# Altium project 2LED_Dice.PrjPcb
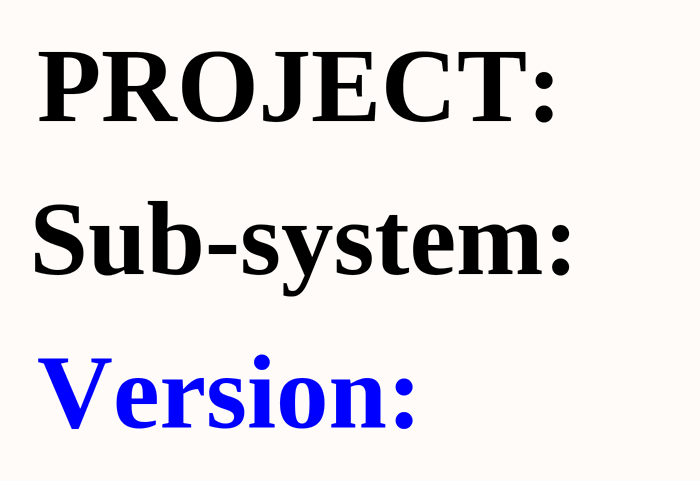
[diagram p0: COVER PAGE.SchDoc]
5 sheets, 54 parts. Net scope: global (net labels, ports and power ports of the same name join across sheets).
Board file: PCB1.PcbDoc
Sheets:
  COVER PAGE.SchDoc
  INDEX.SchDoc
  BLOCK DIAGRAM.SchDoc
  POWER TREE.SchDoc
  SYSTEM.SchDoc

## Sheet COVER PAGE.SchDoc: COVER PAGE
size 420 x 297 mm; Date: March 14; CheckedBy: ThS. Bùi Quốc Bảo; DrawnBy: Nguyễn Gia Huy; Revision: 1.0; SheetNumber: 1; SheetTotal: 5; MasterProject: 2LEDs Dice game; Sub-system: 2LED_Dice.PrjPcb

### Notes on the sheet
- PROJECT:
- Sub-system:
- Version:
- Project:
- Design by:
- Sheet title:
- Sheet
- of
- Checked by:
- Approved by:
- Doc No:
- Revision:
- Size:
- Dates:
- A3

## Sheet INDEX.SchDoc: INDEX
size 420 x 297 mm; Date: March 14; CheckedBy: ThS. Bùi Quốc Bảo; DrawnBy: Nguyễn Gia Huy; Revision: V1.0; SheetNumber: 2; SheetTotal: 5; MasterProject: 2LEDs Dice game; Sub-system: 2LED_Dice.PrjPcb
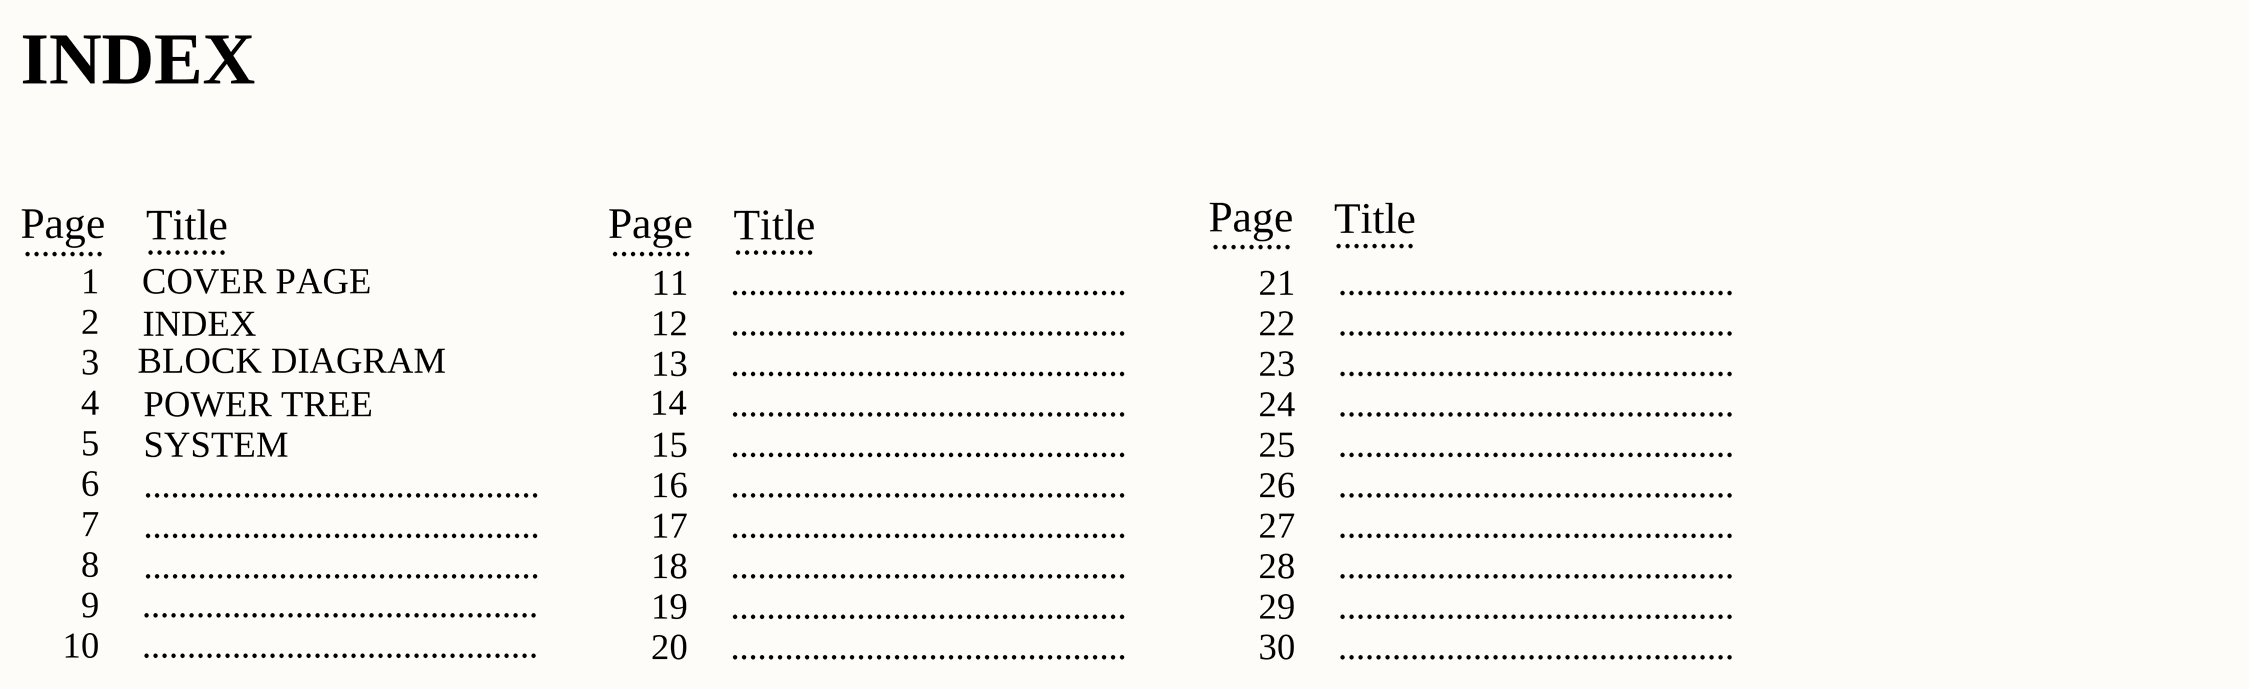
[diagram p1: INDEX.SchDoc]

### Notes on the sheet
- INDEX
- Page
- .........
- Title
- 1
- COVER PAGE
- 11
- ............................................
- 21
- 2
- 3
- BLOCK DIAGRAM
- 12
- 13
- 22
- 23
- 4
- 5
- POWER TREE
- SYSTEM
- 14
- 15
- 24
- 25
- 6
- 16
- 26
- 7
- 8
- 17
- 18
- 27
- 28
- 9
- 10
- 19
- 20
- 29
- 30
- Sub-system:
- Project:
- Design by:
- Sheet title:
- Sheet
- of
- Checked by:
- Approved by:
- Doc No:
- Revision:
- Size:
- Dates:
- A3

## Sheet BLOCK DIAGRAM.SchDoc: BLOCK DIAGRAM
size 420 x 297 mm; Date: March 14; CheckedBy: ThS. Bùi Quốc Bảo; DrawnBy: Nguyễn Gia Huy; Revision: V1.0; SheetNumber: 3; SheetTotal: 5; MasterProject: 2LEDs Dice game; Sub-system: 2LED_Dice.PrjPcb

### Notes on the sheet
- Sub-system:
- Project:
- Design by:
- Sheet title:
- Sheet
- of
- Checked by:
- Approved by:
- Doc No:
- Revision:
- Size:
- Dates:
- A3
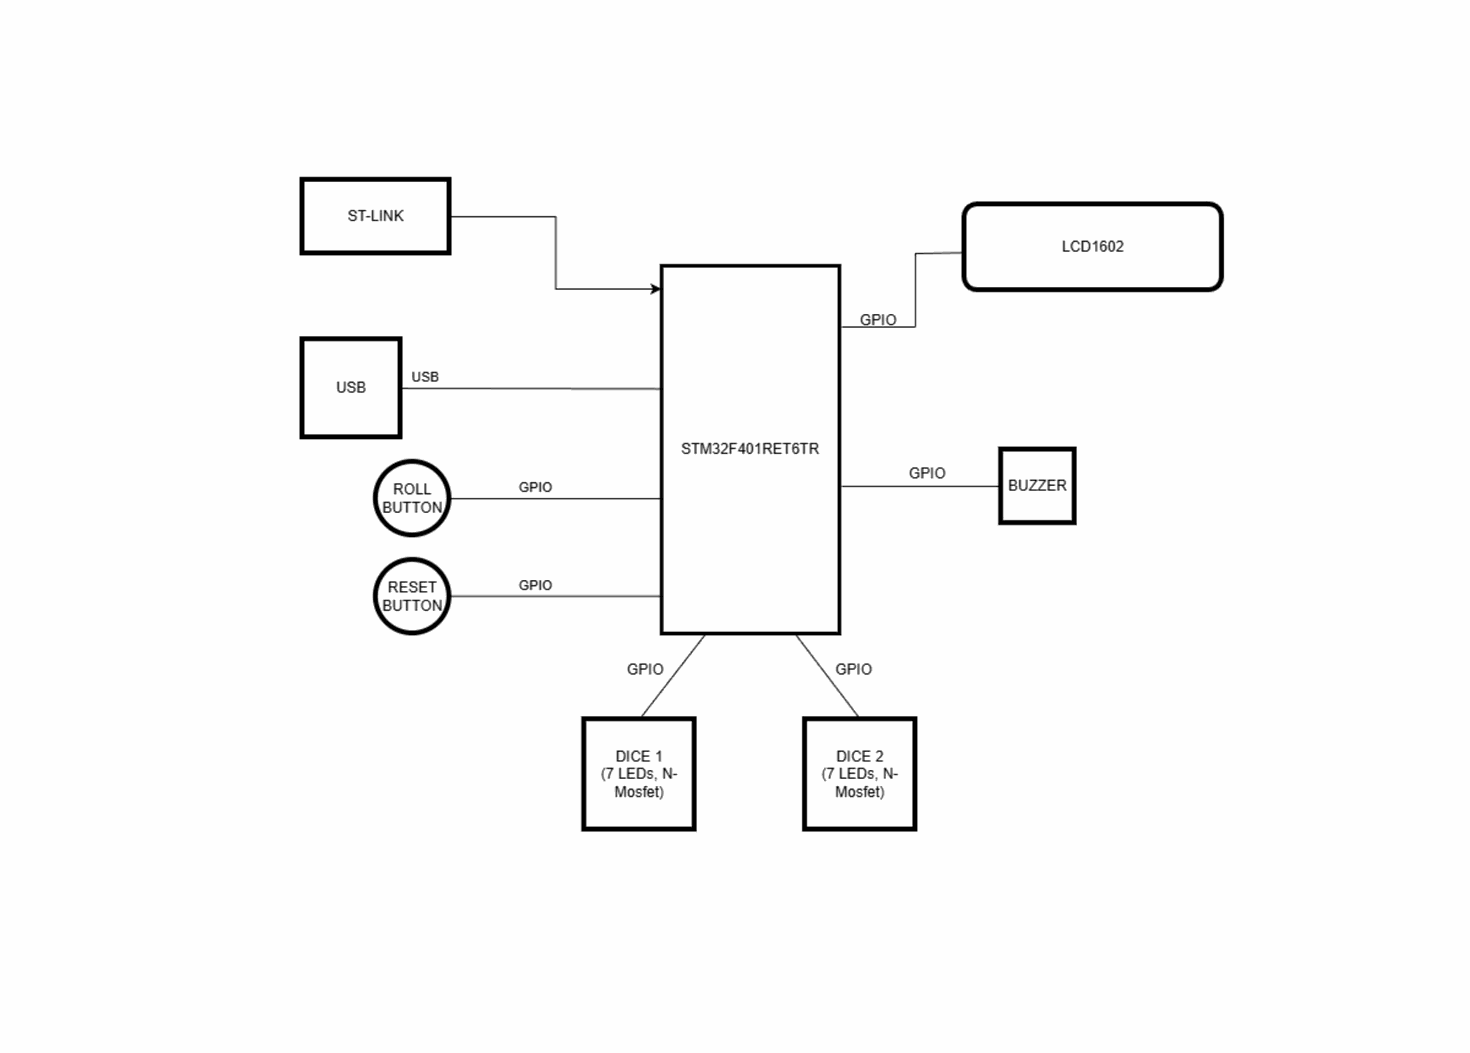
[diagram p2: BLOCK DIAGRAM.SchDoc]

## Sheet POWER TREE.SchDoc: POWER TREE
size 420 x 297 mm; Date: March 14; CheckedBy: ThS. Bùi Quốc Bảo; DrawnBy: Nguyễn Gia Huy; Revision: V1.0; SheetNumber: 4; SheetTotal: 5; MasterProject: 2LEDs Dice game; Sub-system: 2LED_Dice.PrjPcb
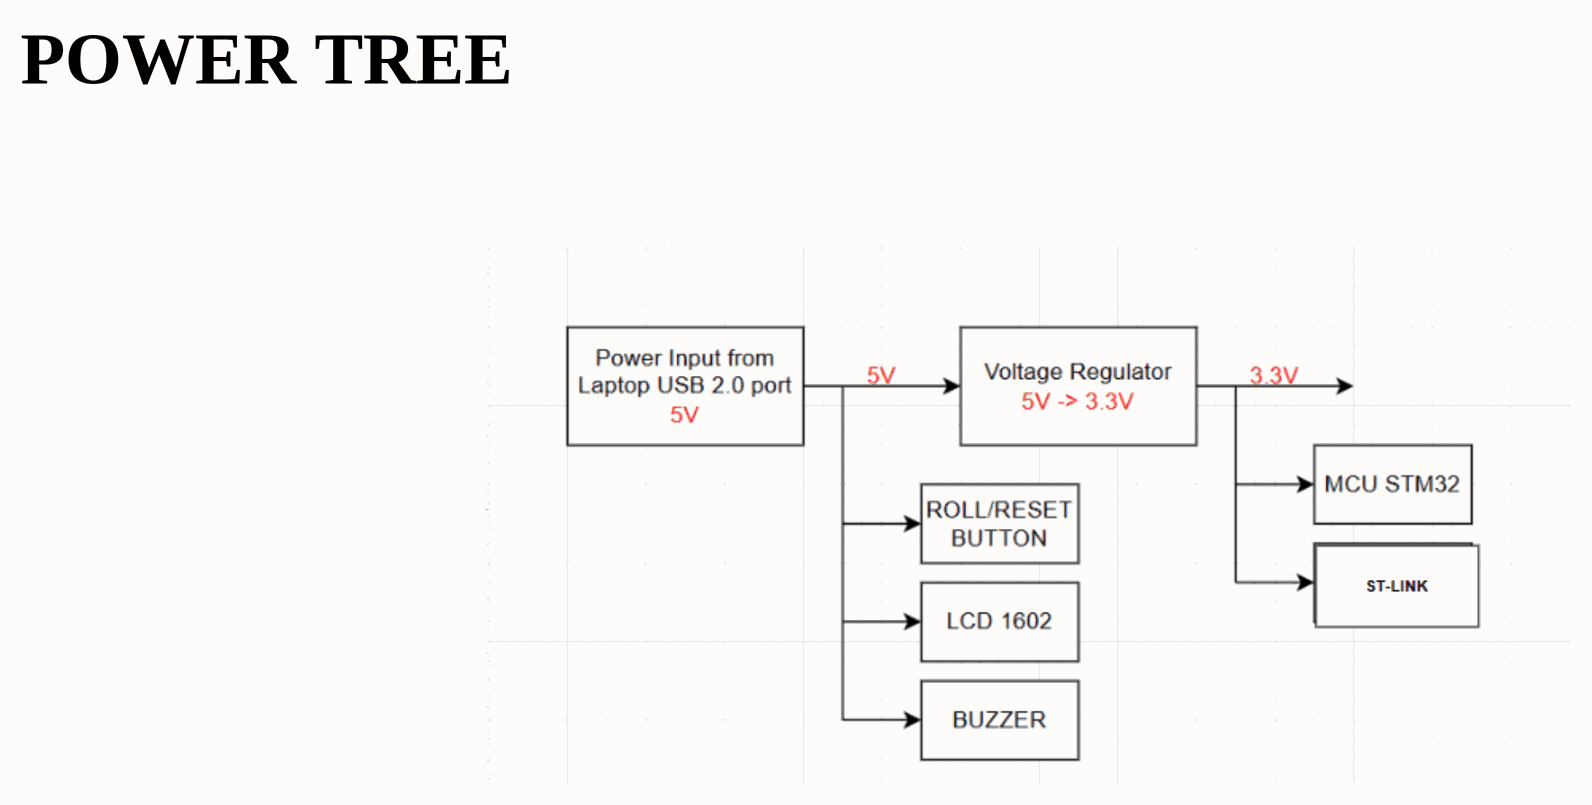
[diagram p3: POWER TREE.SchDoc]

### Notes on the sheet
- POWER TREE
- Sub-system:
- Project:
- Design by:
- Sheet title:
- Sheet
- of
- Checked by:
- Approved by:
- Doc No:
- Revision:
- Size:
- Dates:
- A3

## Sheet SYSTEM.SchDoc: SYSTEM
size 420 x 297 mm; Date: March 14; CheckedBy: ThS. Bùi Quốc Bảo; DrawnBy: Nguyễn Gia Huy; Revision: V1.0; SheetNumber: 5; SheetTotal: 5; MasterProject: 2LEDs Dice game; Sub-system: 2LED_Dice.PrjPcb
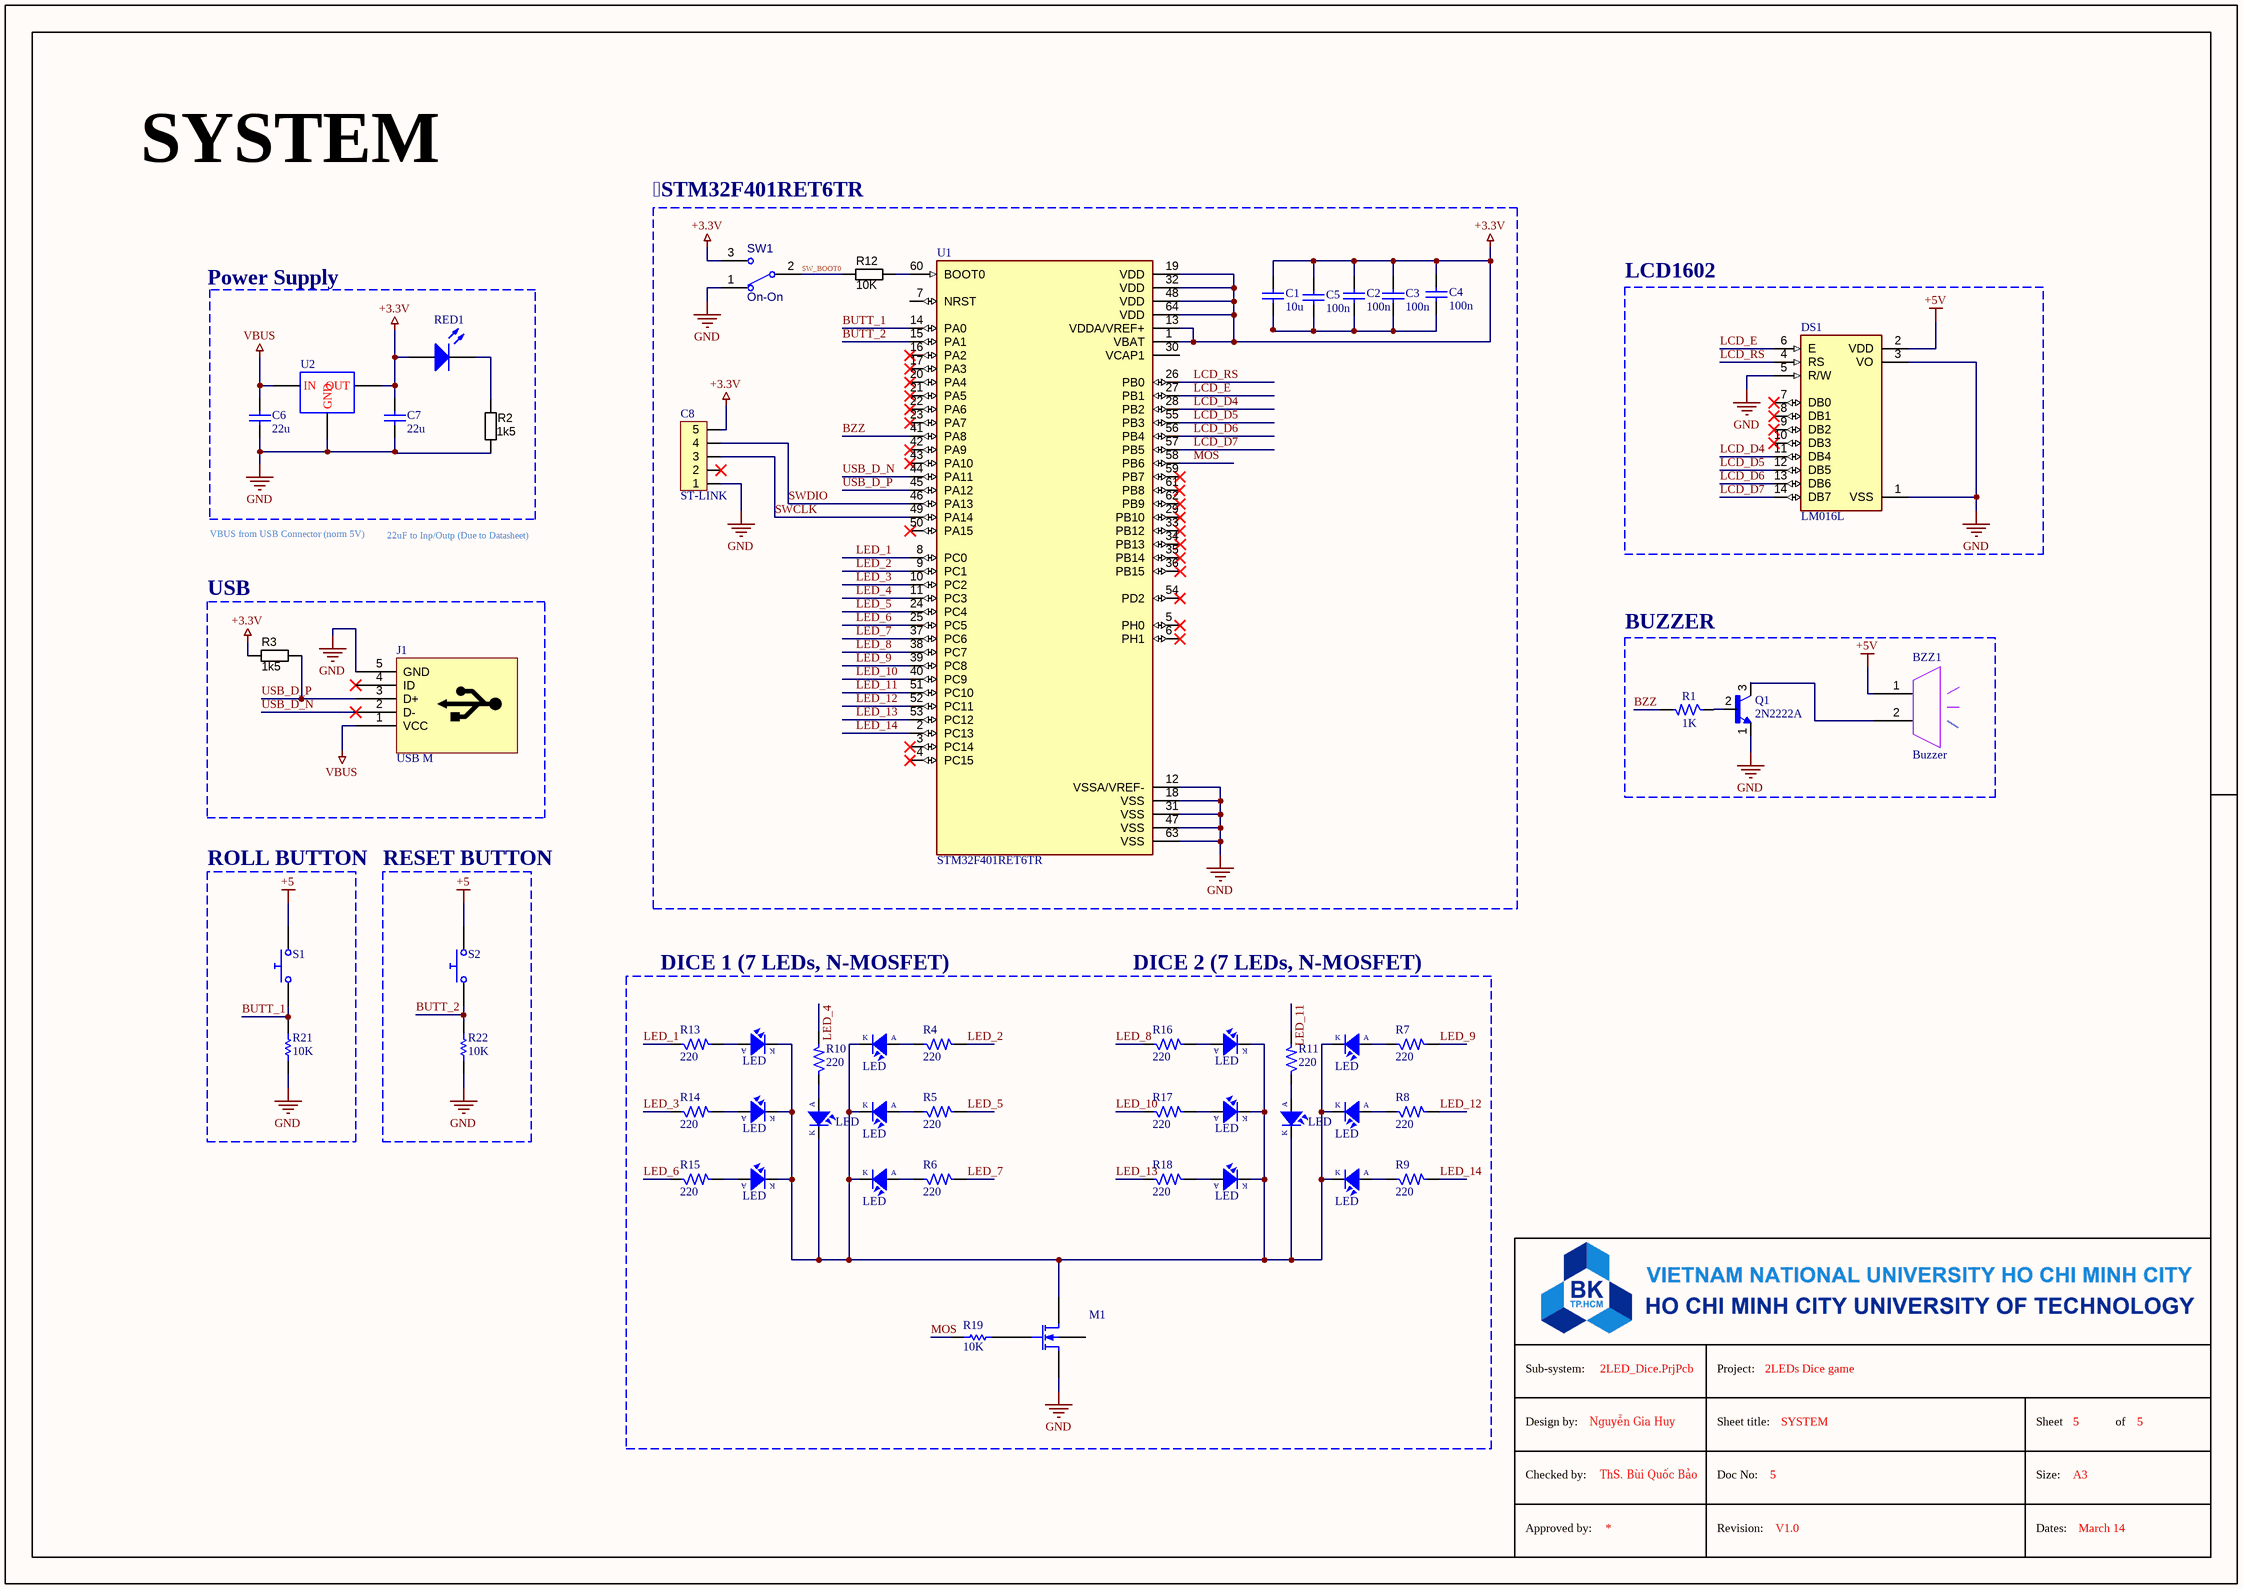
[diagram p4: SYSTEM.SchDoc]

### Parts
BZZ1  Buzzer  [buzzer 5V]
C1  value 10u  [tu 0402]  (hidden comment: Capacitor)
C2  value 100n  [tu 0402]  (hidden comment: Capacitor)
C3  value 100n  [tu 0402]  (hidden comment: Capacitor)
C4  value 100n  [tu 0402]  (hidden comment: Capacitor)
C5  value 100n  [tu 0402]  (hidden comment: Capacitor)
C6  value 22u  [CAPC2012X94N]  (hidden comment: Capacitor)
C7  value 22u  [CAPC2012X94N]  (hidden comment: Capacitor)
C8  ST-LINK  [HDR5]
DS1  LM016L  [MODULE_LCD-16X2]
J1  USB M  [USB-Micr-B-FCI-SMD]
LED1  LED  [LED-3]
LED2  LED  [LED-3]
LED3  LED  [LED-3]
LED4  LED  [LED-3]
LED5  LED  [LED-3]
LED6  LED  [LED-3]
LED7  LED  [LED-3]
LED8  LED  [LED-3]
LED9  LED  [LED-3]
LED10  LED  [LED-3]
LED11  LED  [LED-3]
LED12  LED  [LED-3]
LED13  LED  [LED-3]
LED14  LED  [LED-3]
M1  N-channel MOS1 MOSFET Shichman and Hodges Model  [TO254P1054X469X1930-3]  (value not drawn)
Q1  2N2222A  [TO127P584H533-3]
R1  1K  [RES-SMD-0402]
R2  value 1k5  [RES-SMD-0402]  (hidden comment: Thick Film)
R3  value 1k5  [RES-SMD-0402]  (hidden comment: Thick Film)
R4  220  [RES-SMD-0402]
R5  220  [RES-SMD-0402]
R6  220  [RES-SMD-0402]
R7  220  [RES-SMD-0402]
R8  220  [RES-SMD-0402]
R9  220  [RES-SMD-0402]
R10  220  [RES-SMD-0402]
R11  220  [RES-SMD-0402]
R12  value 10K  [RES-SMD-0402]  (hidden comment: Thick Film)
R13  220  [RES-SMD-0402]
R14  220  [RES-SMD-0402]
R15  220  [RES-SMD-0402]
R16  220  [RES-SMD-0402]
R17  220  [RES-SMD-0402]
R18  220  [RES-SMD-0402]
R19  value 10K  [RES-SMD-0402]  (hidden comment: Resistor)
R21  value 10K  [RES-SMD-0402]  (hidden comment: Resistor)
R22  value 10K  [RES-SMD-0402]  (hidden comment: Resistor)
RED1  Light-Emitting Diode  [LED-RED-0805]  (value not drawn)
S1  Push Button Normally Opened  [SW4_SMD]  (value not drawn)
S2  Push Button Normally Opened  [SW4_SMD]  (value not drawn)
SW1  ON-ON  [SW4_SMD]
U1  STM32F401RET6TR  [QFP50P1200X1200X160-64N]
U2  Positive Fixed Voltage regulator  [AMS1117_3v3]  (value not drawn)

### Blocks framed on the sheet
STM32F401RET6TR: C1-C5 C8 R12 SW1 U1
Power Supply: C6 C7 R2 RED1 U2
LCD1602: DS1
USB: J1 R3
BUZZER: BZZ1 Q1 R1
ROLL BUTTON: R21 S1
RESET BUTTON: R22 S2

### Nets
+3.3V: C1.1 C2.1 C3.1 C4.1 C5.1 C7.1 C8.5 R3.1 RED1.1(A) SW1.3 U1.1(VBAT) U1.13(VDDA/VREF+) U1.19(VDD) U1.32(VDD) U1.48(VDD) U1.64(VDD) U2.3(OUT)
+5: S1.2 S2.2
+5V: BZZ1.1 DS1.2(VDD)
GND: C6.2 C7.2 C8.1 DS1.1(VSS) DS1.3(VO) DS1.5(R/W) J1.5(GND) M1.3(S) Q1.1(E) R2.1 R21.1 R22.1 SW1.1 U1.12(VSSA/VREF-) U1.18(VSS) U1.31(VSS) U1.47(VSS) U1.63(VSS) U2.2(GND)
VBUS: C6.1 J1.1(VCC) U2.1(IN)
BUTT_1: R21.2 S1.1 U1.14(PA0)
BUTT_2: R22.2 S2.1 U1.15(PA1)
BZZ: R1.2 U1.41(PA8)
LCD_D4: DS1.11(DB4) U1.28(PB2)
LCD_D5: DS1.12(DB5) U1.55(PB3)
LCD_D6: DS1.13(DB6) U1.56(PB4)
LCD_D7: DS1.14(DB7) U1.57(PB5)
LCD_E: DS1.6(E) U1.27(PB1)
LCD_RS: DS1.4(RS) U1.26(PB0)
LED_1: R13.1 U1.8(PC0)
LED_2: R4.2 U1.9(PC1)
LED_3: R14.1 U1.10(PC2)
LED_4: R10.2 U1.11(PC3)
LED_5: R5.2 U1.24(PC4)
LED_6: R15.1 U1.25(PC5)
LED_7: R6.2 U1.37(PC6)
LED_8: R16.1 U1.38(PC7)
LED_9: R7.2 U1.39(PC8)
LED_10: R17.1 U1.40(PC9)
LED_11: R11.2 U1.51(PC10)
LED_12: R8.2 U1.52(PC11)
LED_13: R18.1 U1.53(PC12)
LED_14: R9.2 U1.2(PC13)
MOS: R19.2 U1.58(PB6)
SW_BOOT0: R12.2 SW1.2
SWCLK: C8.3 U1.49(PA14)
SWDIO: C8.4 U1.46(PA13)
USB_D_N: J1.2(D-) U1.44(PA11)
USB_D_P: J1.3(D+) R3.2 U1.45(PA12)
NetBZZ1_2: BZZ1.2 Q1.3(C)
NetC1_2: C1.2 C2.2 C3.2 C4.2 C5.2
NetLED1_1: LED1.1(A) R4.1
NetLED1_2: LED1.2(K) LED2.2(K) LED3.2(K) LED4.2(K) LED5.2(K) LED6.2(K) LED7.2(K) LED8.2(K) LED9.2(K) LED10.2(K) LED11.2(K) LED12.2(K) LED13.2(K) LED14.2(K) M1.1(D)
NetLED2_1: LED2.1(A) R5.1
NetLED3_1: LED3.1(A) R6.1
NetLED4_1: LED4.1(A) R7.1
NetLED5_1: LED5.1(A) R8.1
NetLED6_1: LED6.1(A) R9.1
NetLED7_1: LED7.1(A) R10.1
NetLED8_1: LED8.1(A) R11.1
NetLED9_1: LED9.1(A) R13.2
NetLED10_1: LED10.1(A) R14.2
NetLED11_1: LED11.1(A) R15.2
NetLED12_1: LED12.1(A) R16.2
NetLED13_1: LED13.1(A) R17.2
NetLED14_1: LED14.1(A) R18.2
NetM1_2: M1.2(G) R19.1
NetQ1_2: Q1.2(B) R1.1
NetR2_2: R2.2 RED1.2(K)
NetR12_1: R12.1 U1.60(BOOT0)

Not connected (* = marked no-connect by the designer): C8 2*; DS1 7(DB0)* 8(DB1)* 9(DB2)* 10(DB3)*; J1 4(ID)*; M1 4(B); U1 3(PC14)* 4(PC15)* 5(PH0)* 6(PH1)* 7(NRST) 16(PA2)* 17(PA3)* 20(PA4)* 21(PA5)* 22(PA6)* 23(PA7)* 29(PB10)* 30(VCAP1) 33(PB12)* 34(PB13)* 35(PB14)* 36(PB15)* 42(PA9)* 43(PA10)* 50(PA15)* 54(PD2)* 59(PB7)* 61(PB8)* 62(PB9)*

### Notes on the sheet
- SYSTEM
- VBUS from USB Connector (norm 5V)
- 22uF to Inp/Outp (Due to Datasheet)
- DICE 1 (7 LEDs, N-MOSFET)
- DICE 2 (7 LEDs, N-MOSFET)
- Sub-system:
- Project:
- Design by:
- Sheet title:
- Sheet
- of
- Checked by:
- Approved by:
- Doc No:
- Revision:
- Size:
- Dates:
- A3

### Library data of the parts
C1-C7 = Capacitor: SimulationGenericComponent: True
C8 = Header5: Header IDC, 5 x 1 Pin Vertical 2.54mm Pitch (Non-Boxed, Male); Manufacturer: W¨¹rth Elektronik eiSos GmbH; partNo: 613002143121; ComponentLink1 Description: Manufacturer; ComponentLink2 Description: Datasheet; NoPins: 02; Created Date: 29 March 2013; ComponentLink1URL: http://www.we-online.com; ComponentLink2URL: http://katalog.we-online.de/em/datasheet/6130xx143121.pdf; Created by: Karrer Zheng
DS1 = LM016L: Display Lcd 35x75mm; MF: Hitachi; Price: None; Availability: Not in stock; Package: None; MP: LM016L; Value: *; SnapEDA_Link: https://www.snapeda.com/parts/LM016L/Hitachi/view-part/?ref=snap; Check_prices: https://www.snapeda.com/parts/LM016L/Hitachi/view-part/?ref=eda
LED1-LED14 = LED: LED Single colour Green and Red; Value: LED 3 ly Single Colour
M1 = MOSFET N-ch Lev1: CBD: 0; FC: 0.5; IS: 1e-14; KP: 2e-05; PB: 0.8; PHI: 0.6; TNOM: 27; SimulationGenericComponent: True; CBS: 0; CGBO: 0; CGDO: 0; CGSO: 0; CJ: 0; CJSW: 0; GAMMA: 0; JS: 0; LAMBDA: 0; LD: 0; MJ: 0.5; MJSW: 0.5; NSS: 0; NSUB: 0; RD: 0; RS: 0; RSH: 0; TOX: 0; TPG: 0; U0: 0; VTO: 0
Q1 = 2N2222A: Bipolar (BJT) Transistor NPN 50 V 800 mA - 500 mW Surface Mount 4-SMD; MF: Microsemi Corporation; SnapEDA_Link: https://www.snapeda.com/parts/2N2222A/Microsemi/view-part/?ref=snap; Package: None; Value: *; MP: 2N2222A; Check_prices: https://www.snapeda.com/parts/2N2222A/Microsemi/view-part/?ref=eda
R1 R4-R11 R13-R18 = Res
R2 R3 R12 = RES_0402: Resistor SMD chip 1k Ohm 0.063W 5% 0402; Manufacturer 1: Yageo; Manufacturer Part Number 1: RC0402JR-071KL; Ratings: 1/16 W; SCDType: spec; Package / Case: 0402 (1005 Metric); Tolerance: ±5%; Supplier 1: Digi-Key; Supplier Part Number 1: 311-1.0KJRCT-ND; RoHS 1: RoHS Compliant; ComponentLink1URL: http://www.yageo.com/documents/recent/PYu-RC0402_51_RoHS_L_6.pdf; ComponentLink1Description: http://www.yageo.com/documents/recent/PYu-RC0402_51_RoHS_L_6.pdf; Supplier 2: Digi-Key; Supplier Part Number 2: 541-1.0KJCT-ND; Manufacturer 2: Vishay Dale; Manufacturer Part Number 2: CRCW04021K00JNED; RoHS 2: RoHS Compliant; ComponentLink2URL: http://www.vishay.com/doc?20035; ComponentLink2Description: http://www.vishay.com/doc?20035; Supplier 3: Digi-Key; Supplier Part Number 3: 1276-4376-1-ND; Manufacturer 3: Samsung Electro-Mechanics America, Inc; Manufacturer Part Number 3: RC1005J102CS; RoHS 3: RoHS Compliant; ComponentLink3URL: http://www.samsungsem.com/servlet/FileDownload?filename=productcatalog/pdf/Chip_Resistor.pdf; ComponentLink3Description: http://www.samsungsem.com/servlet/FileDownload?filename=productcatalog/pdf/Chip_Resistor.pdf; Supplier 4: Digi-Key; Supplier Part Number 4: RHM1.0KCECT-ND; Manufacturer 4: Rohm Semiconductor; Manufacturer Part Number 4: MCR01MRTJ102; RoHS 4: RoHS Compliant; ComponentLink4URL: http://rohmfs.rohm.com/en/products/databook/datasheet/passive/resistor/chip_resistor/mcr_g.pdf; ComponentLink4Description: http://rohmfs.rohm.com/en/products/databook/datasheet/passive/resistor/chip_resistor/mcr_g.pdf; Supplier 5: Digi-Key; Supplier Part Number 5: P1.0KJCT-ND; Manufacturer 5: Panasonic Electronic Components; Manufacturer Part Number 5: ERJ-2GEJ102X; RoHS 5: RoHS Compliant; ComponentLink5URL: http://industrial.panasonic.com/www-cgi/jvcr13pz.cgi?E+PZ+3+AOA0001+ERJ2GEJ102X+7+WW; ComponentLink5Description: http://industrial.panasonic.com/www-cgi/jvcr13pz.cgi?E+PZ+3+AOA0001+ERJ2GEJ102X+7+WW
R19 R21 R22 = Resistor: TC1: 0; SimulationGenericComponent: True; TC2: 0
RED1 = LED: AF: 1; BV: 0; BV_MAX: 1e99; EG: 1.11; FC: 0.5; IBV: 0.001; IS: 1e-14; MJSW: 0.33; NTUN: 30; TNOM: 27; XTI: 3; SimulationGenericComponent: True; CJO: 0; CJP: 0; CTA: 0; CTP: 0; FCS: 0.5; FV_MAX: 1e99; IKF: 0; IKR: 0; ISR: 1e-14; JSW: 0; JTUN: 0; JTUNSW: 0; KEG: 1; KF: 0; LEVEL: 1; N: 1; NBV: 1; NR: 1; NS: 1; PHP: 1; RS: 0; TCV: 0; TLEV: 0; TLEVC: 0; TM1: 0; TM2: 0; TPB: 0; TPHP: 0; TRS: 0; TRS2: 0; TT: 0; TTT1: 0; TTT2: 0; VJ: 1; XTITUN: 3
S1 S2 = Push Button NO: closed: 0; Rclosed: 1m; Ropen: 1Meg; SimulationGenericComponent: True
SW1 = SW_THD_SPDT_On-On: Switch THD vertical toggle SPDT; Manufacturer 1: TE Connectivity; Manufacturer Part Number 1: SLS121PC04; Contact Rating @ Voltage: 0.25A @ 125VAC; SCDType: spec; Circuit: SPDT; Mounting Type: PCB mount; Supplier 1: Digi-Key; Supplier Part Number 1: 450-1598-ND; Switch Function: On-On
U1 = STM32F401RET6TR: ARMÂ® CortexÂ®-M4 STM32F4 Microcontroller IC 32-Bit Single-Core 84MHz 512KB (512K x 8) FLASH 64-LQFP (10x10); MF: STMicroelectronics; SnapEDA_Link: https://www.snapeda.com/parts/STM32F401RET6TR/STMicroelectronics/view-part/?ref=snap; Package: LQFP-64 STMicroelectronics; Value: *; MP: STM32F401RET6TR; Check_prices: https://www.snapeda.com/parts/STM32F401RET6TR/STMicroelectronics/view-part/?ref=eda
U2 = Linear Voltage Regulator (Fixed): Av_feedback: 1665; R1_Value: 1020; SimulationGenericComponent: True